# EAGLE design GBC USB-C Charging Kit (EAGLE 6.2)
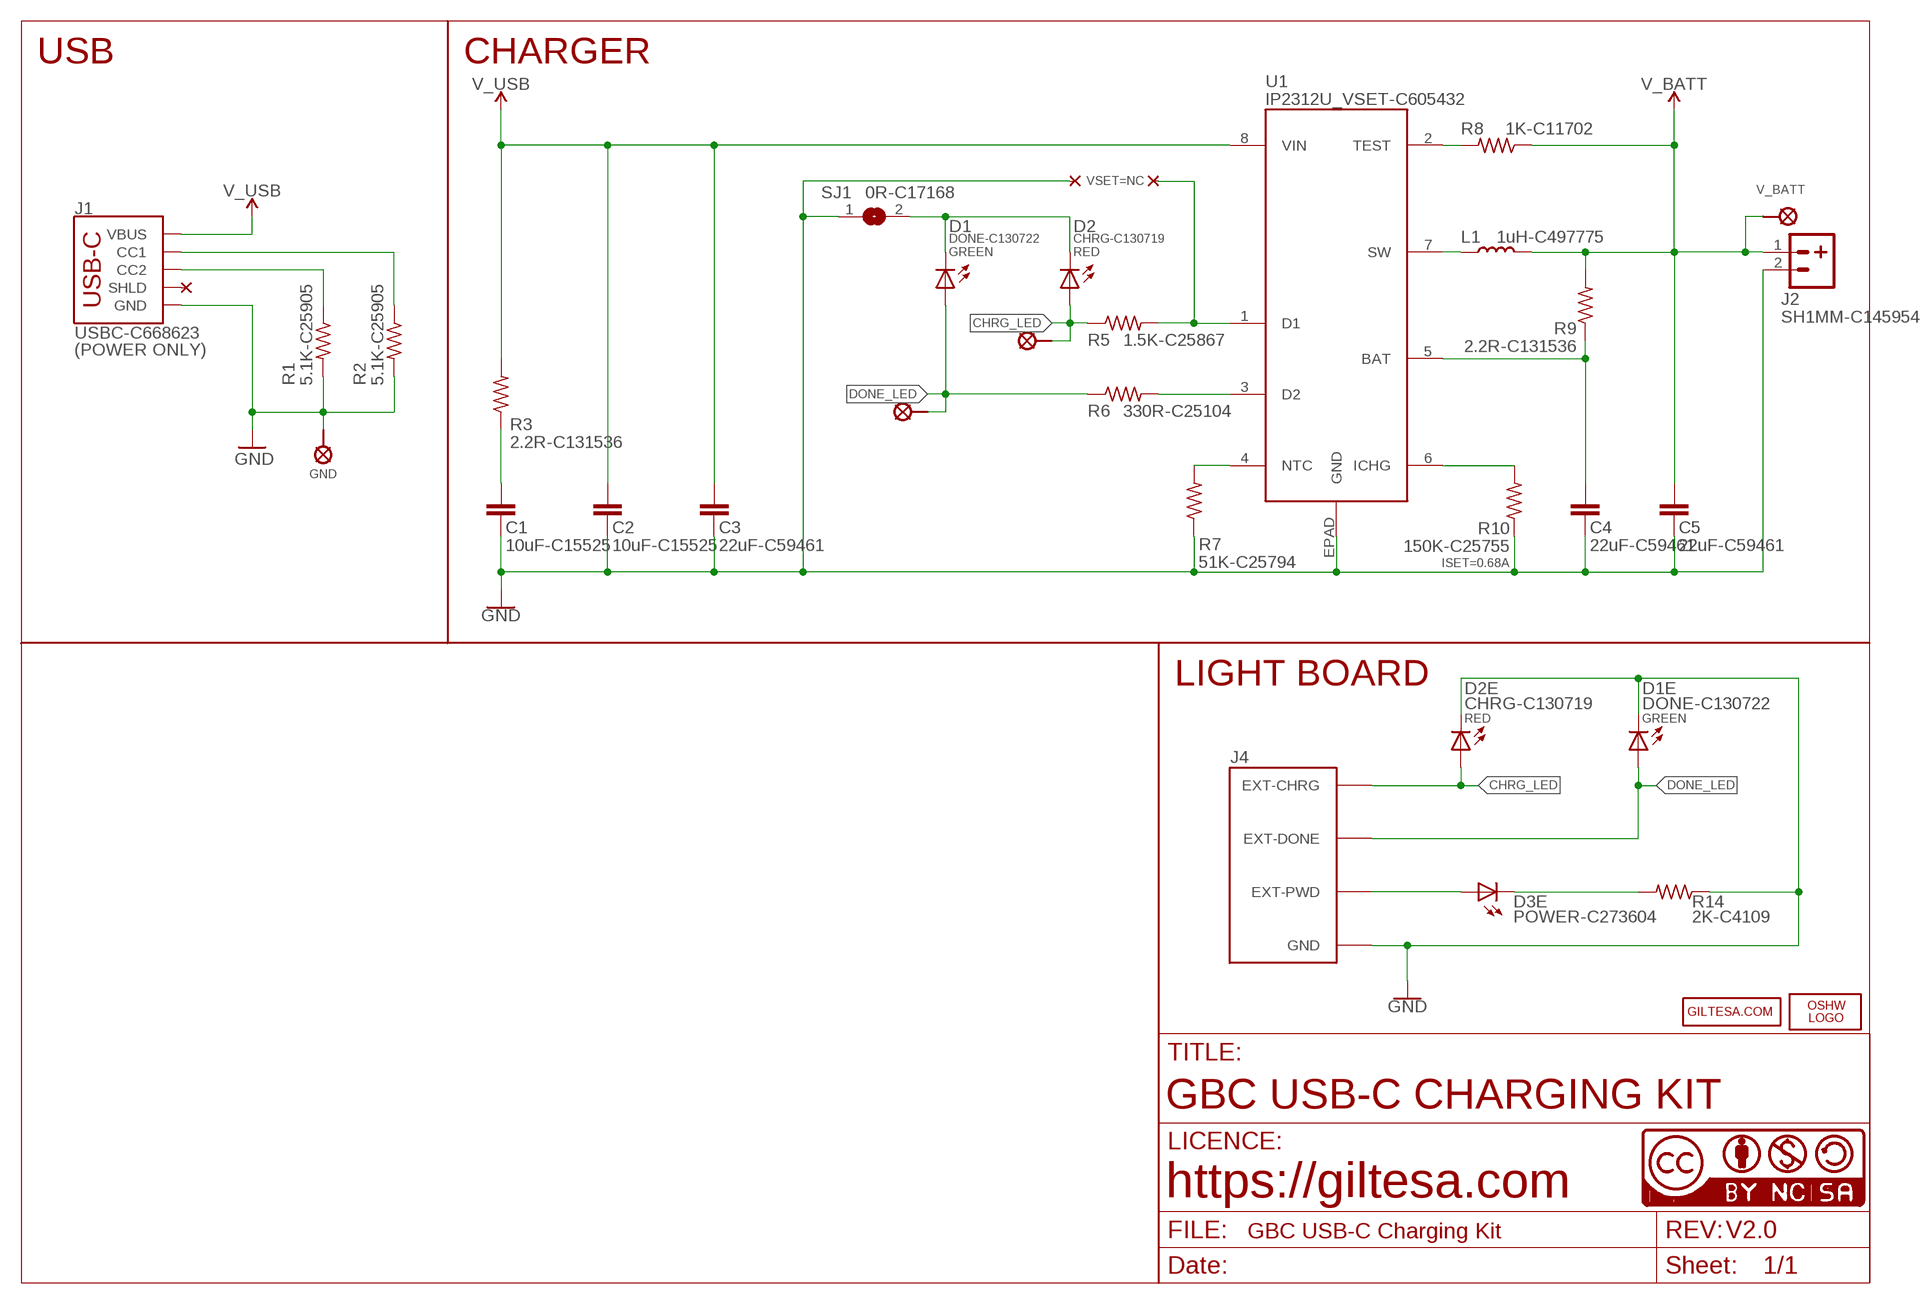
[diagram p0: schematic, sheet 1]

## Parts
C1  10uF-C15525  C0402_S  [C0402_S]
C2  10uF-C15525  C0402_S  [C0402_S]
C3  22uF-C59461  C0603_SMALL  [C0603_S]
C4  22uF-C59461  C0603_SMALL  [C0603_S]
C5  22uF-C59461  C0603_SMALL  [C0603_S]
D1  DONE-C130722  LED_0402  [L0402]
D1E  DONE-C130722  LED_0402  [L0402]
D2  CHRG-C130719  LED_0402  [L0402]
D2E  CHRG-C130719  LED_0402  [L0402]
D3E  POWER-C273604  LED_0402  [L0402]
J1  USBC-C668623  USB-C_6P_POWER  [USB-C_6P]
J2  SH1MM-C145954  JST-21MM  [JST-2-1MM-SMD_RIGHT]
J4  GBC_LED_V2  [GBC_LED_V2]
L1  1uH-C497775  INDUCTOR_2  [PSPMAA0402]
LOGO2  OSHW_LOGO_FILLX0150-NT  [OSHW_FILLX150_NOTEXT]
R1  5.1K-C25905  R0402  [R0402]
R2  5.1K-C25905  R0402  [R0402]
R3  2.2R-C131536  R0402  [R0402]
R5  1.5K-C25867  R0402  [R0402]
R6  330R-C25104  R0402  [R0402]
R7  51K-C25794  R0402  [R0402]
R8  1K-C11702  R0402  [R0402]
R9  2.2R-C131536  R0402  [R0402]
R10  150K-C25755  R0402  [R0402]
R14  2K-C4109  R0402  [R0402]
SJ1  0R-C17168  JUMPER-SMD0402  [JUMPER-SMD_0402]
U1  IP2312U_VSET-C605432  IP2312_CUSTOM  [IP2312]
U$1  V_BATT  PAD_1.25  [PAD_1.25]
U$2  GND  PAD_1.25  [PAD_1.25]
U$6  CC-BY-NC-SA15MM  [CC-BY-NC-SA_15MM]
U$16  GILTESA.COM_MASK  [GILTESA.COM_MASK_15MM]
U$17  CC-NC-BCNIX  [CC-NC-B_NIX]
U$24  CHRG_LED  SOLDER_PAD-1.3  [SOLDER_PAD_1.3]
U$25  DONE_LED  SOLDER_PAD-1.3  [SOLDER_PAD_1.3]

## Nets
CHRG_LED: D2.A D2E.A J4.EXT-CHRG R5.1 U$24.P$1
DONE_LED: D1.A D1E.A J4.EXT-DONE R6.1 U$25.P$1
GND: C1.1 C2.1 C3.1 C4.1 C5.1 D1E.C D2E.C J1.A12-GND(GND) J1.B12-GND(GND) J2.2 J4.GND R1.2 R2.2 R7.1 R10.1 R14.1 SJ1.1 U1.EPAD(GND) U$2.P$1
N$1: D1.C D2.C SJ1.2
N$4: J1.B5(CC2) R1.1
N$6: R8.2 U1.2(TEST)
N$10: D3E.A J4.EXT-PWD
N$11: D3E.C R14.2
N$13: J1.A5(CC1) R2.1
N$14: C4.2 R9.1 U1.5(BAT)
N$15: C1.2 R3.1
N$19: R5.2 U1.1(D1)
N$27: R7.2 U1.4(NTC)
N$28: R10.2 U1.6(ICHG)
N$29: R6.2 U1.3(D2)
N$31: L1.P$1 U1.7(SW)
V_BATT: C5.2 J2.1 L1.P$2 R8.1 R9.2 U$1.P$1
V_USB: C2.2 C3.2 J1.A9-VBUS(VBUS) J1.B9-VBUS(VBUS) R3.2 U1.8(VIN)
Unconnected: J1.SHLD1(SHLD) J1.SHLD2(SHLD) J1.SHLD3(SHLD) J1.SHLD4(SHLD)

## Notes on the sheet
- USB | CHARGER
- VSET=NC
- GREEN | RED
- (POWER ONLY)
- ISET=0.68A
- LIGHT BOARD
- RED | GREEN
- GBC USB-C CHARGING KIT
- https://giltesa.com
- V2.0

## Library data of the parts
C1 C2 = ,giltesa:C0402
C3-C5 = ,giltesa:C0603
D1 D1E D2 D2E D3E = ,giltesa:LED
J1 = ,giltesa:USB-C_6P
J2 = ,giltesa:JST-2
J4 = ,giltesa:GBC_LED_V2
L1 = ,giltesa:INDUCTOR
LOGO2 = ohw-logo:OSHW_LOGO_FILL
R1-R3 R5-R10 R14 = ,giltesa:R0402
SJ1 = ,giltesa:JUMPER-SMD
U1 = ,giltesa:IP2312
U$1 U$2 = ,giltesa:PAD
U$6 = ,giltesa_logos:CC-BY-NC-SA
U$16 = ,giltesa_logos:GILTESA.COM
U$17 = cc-by-nc-sa:CC-NC-BC: All hardware is licensed under the Creative Commons Attribution-Noncommercial-Share Alike 2.5 Switzerland License. To view a copy of this license, visit http://creativecommons.org/licenses/by-nc-sa/2.5/ch/ or send a letter to Creative Commons, 171 Second Street, Suite 300, San Francisco, California, 94105, USA.
U$24 U$25 = ,giltesa:SOLDER_PAD

## Net classes
1 power: width 0.61 mm, drill 0.406 mm, clearance 0.203 mm
2 gnd: width 0.305 mm, drill 0.406 mm, clearance 0.203 mm
3 power usb: width 0.508 mm, drill 0.406 mm, clearance 0.203 mm

## Board
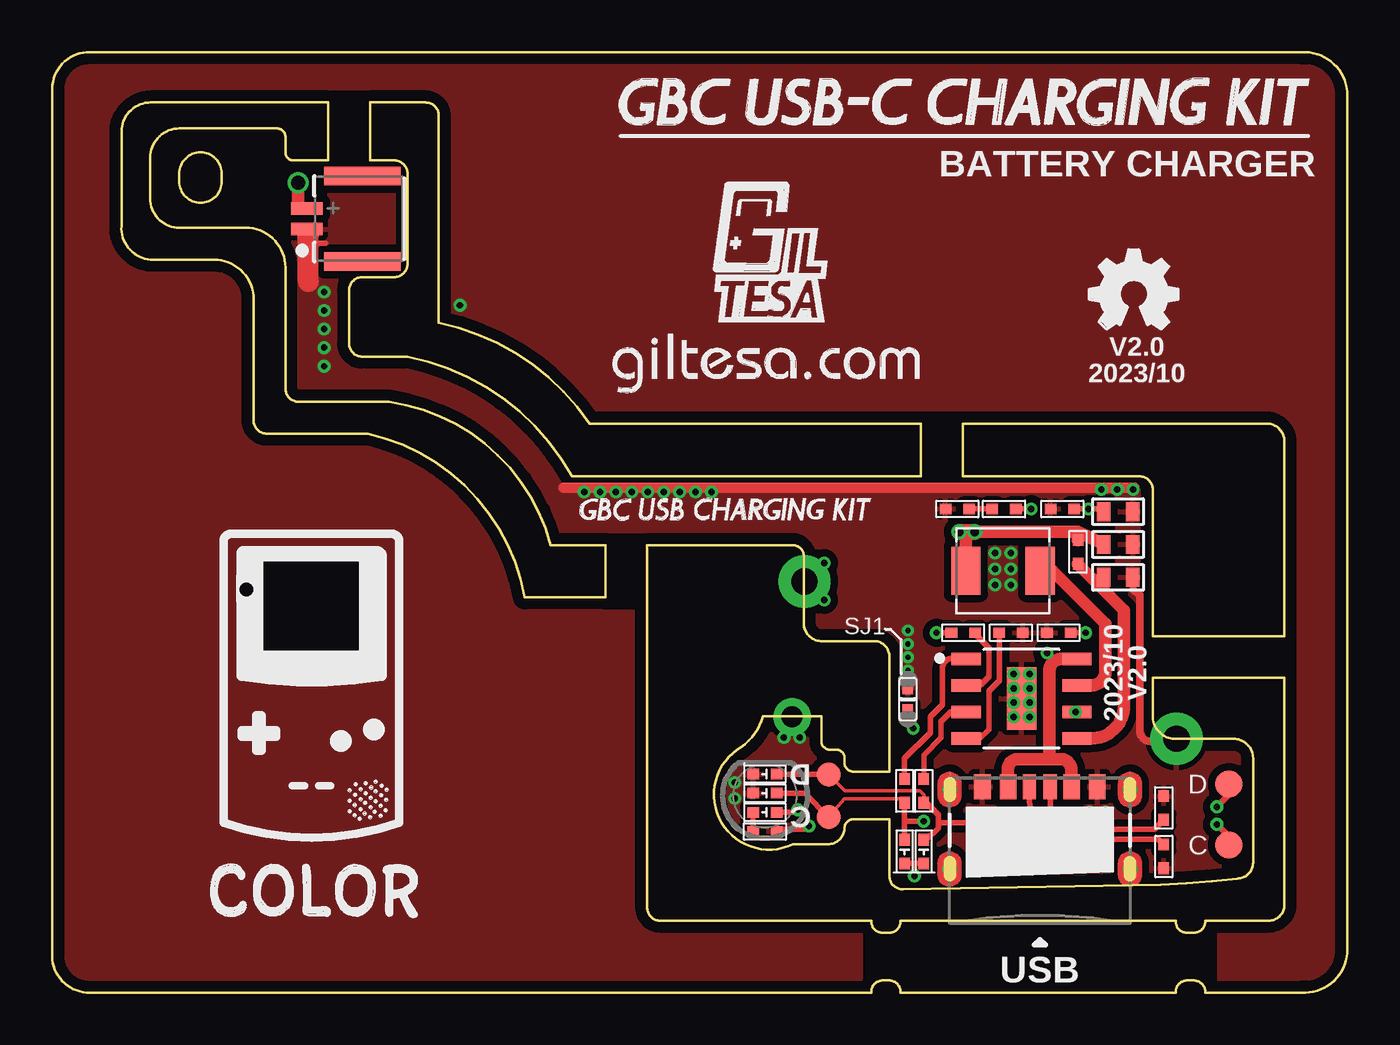
[diagram p1: board, top side]
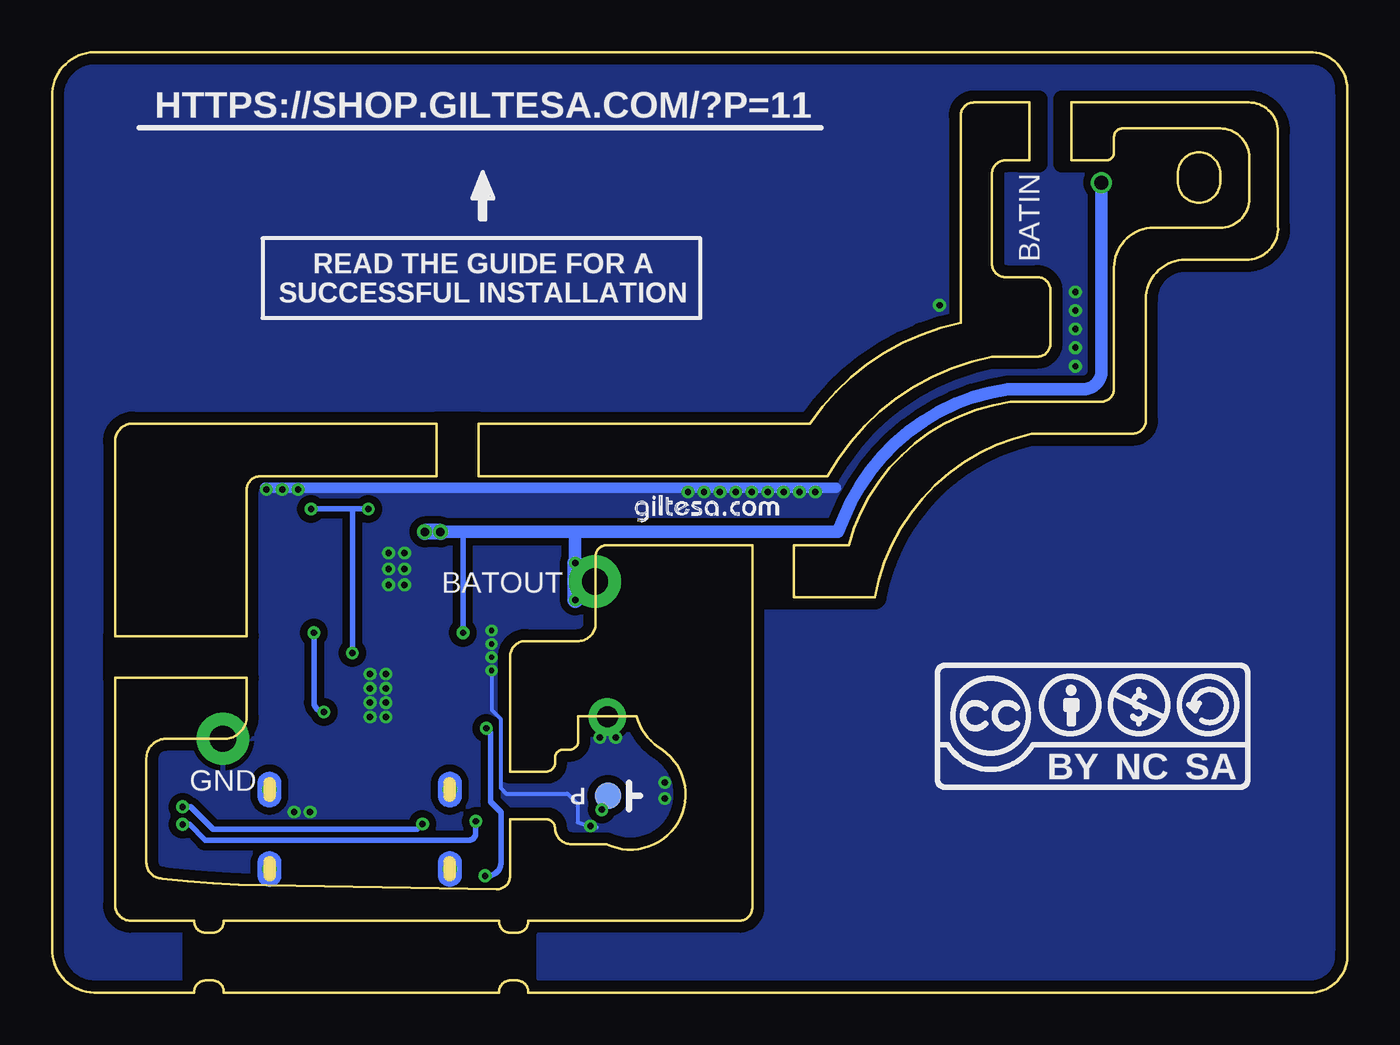
[diagram p2: board, bottom side, seen from below]

Size 62 x 45.01 mm. Coordinates in mm from the lower left corner, seen from the top.
Outline: 57.49,11.13 57.49,6.21 arc-90 56.75,5.46 arc-5 53.07,5.16 40.72,4.94 arc-90 40.09,5.58 40.09,8.3 38.39,8.3 arc90 37.94,7.92 arc-90 37.14,7.1 35.46,7.1 arc-170 32.79,11.63 arc45 34.03,13.22 36.82,13.22 36.82,12.08 arc90 37.2,11.63 37.56,11.63 arc-90 37.94,11.19 37.94,11.03 arc90 38.31,10.58 40.09,10.58 40.09,16.13 arc90 39.31,16.83 36.79,16.83 arc-90 35.99,17.75 35.99,20.91 arc90 35.42,21.42 28.49,21.42 28.49,4.09 arc90 29.09,3.44 39.22,3.44 arc90 39.73,2.87 40.11,2.87 arc90 40.61,3.44 53.79,3.44 arc90 54.3,2.87 54.68,2.87 arc90 55.2,3.44 58.25,3.44 arc90 58.99,4.2 58.99,15.07 52.69,15.07 52.69,13.17 arc90 53.84,12.15 56.63,12.15 arc-90 57.49,11.13
Outline: 1.64,0 39.22,0 arc-90 39.73,0.58 40.11,0.58 arc-90 40.61,0 53.79,0 arc-90 54.3,0.58 54.68,0.58 arc-90 55.2,0 59.81,0 arc90 62,1.91 62,43.1 arc90 59.81,45 1.64,45 arc90 0,43.1 0,1.91 arc90 1.64,0
Outline: 24.88,24.71 41.59,24.71 41.59,27.24 25.72,27.24 arc44 18.51,32.06 18.51,41.98 arc90 17.87,42.61 15.21,42.61 15.21,39.84 16.37,39.84 arc-90 17.01,39.2 17.01,34.88 arc-90 16.37,34.25 14.85,34.25 arc90 14.21,33.61 14.21,31.07 arc90 14.85,30.44 17.01,30.44 arc-50 24.88,24.71
Outline: 43.59,24.71 52.06,24.71 arc-90 52.69,24.09 52.69,17.07 58.99,17.07 58.99,26.37 arc90 58.16,27.24 43.59,27.24 43.59,24.71
Outline: 16.12,28.28 11.8,28.28 arc-90 11.17,28.91 11.17,34.7 arc90 9.26,36.61 6.09,36.61 arc-90 4.69,38.01 4.69,39.96 arc-90 6.09,41.36 10.78,41.36 arc-90 11.17,40.98 11.17,40.22 arc90 11.55,39.84 13.21,39.84 13.21,42.61 4.71,42.61 arc90 3.32,41.21 3.32,36.68 arc90 4.71,35.09 7.74,35.09 arc-90 9.64,33.18 9.64,27.39 arc90 10.28,26.75 15.12,26.75 arc-67 22.62,18.92 26.49,18.92 26.49,21.42 23.87,21.42 arc67 16.12,28.28
Outline: 6.09,39.2 arc-180 8.12,39.2 8.12,38.82 arc-180 6.09,38.82 6.09,39.2
Copper layers (1*16): Top 0.035mm / dielectric 1.6mm / Bottom 0.035mm
Design rules: minimum track width 6mil, minimum drill 12mil, track to track 6mil, track to pad 6mil, pad to pad 6mil, via to via 8mil, smd to smd 0mil, copper to edge 20mil, drill to drill 10mil, minimum pad ring 6mil, minimum via ring 6mil, stop-mask expansion 0mil, vias tented up to drill 100mil, thermal gap 10mil
tRestrict: area 10.4,16.6 to 14.5,20.4; area 9.4,19.3 to 9.4,19.3; 16 lines
bRestrict: 20 lines

### Footprints (pad centres in the part's own frame; a part is rotated, then mirrored left to right if it is on the bottom)
C0402_S = smd 0.559 x 0.5: 1 -0.567,0; 2 0.567,0
C0603_S = smd 0.635 x 0.9: 1 -0.694,0; 2 0.694,0
L0402 = smd 0.559 x 0.5: A 0.567,0; C -0.567,0
USB-C_6P = smd 0.635 x 1.2: A5 -0.5,2.034; B5 0.5,2.034 | smd 0.8 x 1.2: A9-VBUS 1.52,2.034; A12-GND 2.75,2.034; B9-VBUS -1.52,2.034; B12-GND -2.75,2.034 | drill 0.4 pad 0.6: SHLD1 -4.318,1.9; SHLD2 4.32,1.9; SHLD3 -4.318,-1.9; SHLD4 4.32,-1.9
JST-2-1MM-SMD_RIGHT = smd 0.6 x 1.524: 1 -0.5,-2.017; 2 0.5,-2.017 | smd 0.889 x 3.683: NC1 -2.054,0.635; NC2 2.054,0.635
GBC_LED_V2 = smd 1.143 x 1.143: EXT-CHRG -3.048,1.016; EXT-DONE -3.048,-1.016 | smd 1.27 x 1.27 bottom: EXT-PWD -1.27,0 | drill 1 pad 1.8: GND -1.293,-3.778
PSPMAA0402 = smd 1.4 x 2.3: P$1 -1.775,0; P$2 1.775,0
R0402 = smd 0.559 x 0.5: 1 -0.567,0; 2 0.567,0
JUMPER-SMD_0402 = smd 0.635 x 0.5: 1 -0.559,0; 2 0.559,0
IP2312 = smd 1.4 x 0.6: 1 -2.65,1.905; 2 -2.65,0.635; 3 -2.65,-0.635; 4 -2.65,-1.905; 5 2.65,-1.905; 6 2.65,-0.635; 7 2.65,0.635; 8 2.65,1.905 | smd 1.4 x 3: EPAD 0,0
PAD_1.25 = drill 1.25 pad 2.5: P$1 0,0
SOLDER_PAD_1.3 = smd 1.3 x 1.3: P$1 0,0

### Placement (x,y rotation side)
C1  43.34,23.15 0 top
C2  48.37,23.15 0 top
C3  51.03,23.02 180 top
C4  51.03,19.88 180 top
C5  51.03,21.45 180 top
D1  41.73,6.75 90 top
D1E  34.13,10.46 0 top
D2  40.81,6.75 90 top
D2E  34.13,9.55 0 top
D3E  34.13,8.63 0 top
J1  47.28,7.82 0 top
J2  14.21,37.04 270 top
J4  34.13,9.42 180 top
L1  45.52,20.2 180 top
LOGO2  49.66,31.75 0 top
R1  53.22,8.84 90 top
R2  53.22,6.52 270 top
R3  45.57,23.15 0 top
R5  40.81,9.66 90 top
R6  41.73,9.66 90 top
R7  45.9,17.23 180 top
R8  43.61,17.23 0 top
R9  49.11,21.1 90 top
R10  48.19,17.23 0 top
R14  34.13,7.72 180 top
SJ1  40.97,14.05 270 top
U1  46.41,14.07 0 top
U$1  36.01,19.68 0 top
U$2  53.83,12.16 0 top
U$3  [GBC_FRAME]  27.18,41.47 0 top
U$6  19.75,9.7 0 bottom
U$8  [GBC_FRAME_LOGO]  7.53,3.56 0 top
U$14  [GAME_BOY_COLOR_USB_CHARGING_KIT_NON]  25.15,22.61 0 top
U$16  26.71,28.6 0 top
U$17  0,0 0 top
U$18  [GILTESA_LOGO_MASK_7MM]  31,32 0 top
U$24  56.33,7.07 0 top
U$25  56.33,9.99 0 top
U$28  [GILTESA.COM_MASK_7MM@1]  34.14,22.46 0 bottom

### Tracks (layer width: path | path; a pad name or v marks a point on that pad's centre or on a via)
CHRG_LED  (via drill 0.3)
  Top 0.178: R5.1 40.56,9.28 37.94,9.28 J4.EXT-CHRG
  Top 0.254: D2E.A 36.03,9.55 J4.EXT-CHRG | D2.A 40.81,8.21 | R5.1 40.81,8.21 | 40.81,8.21 v41.73,8.21 | U$24.P$1 56.33,7.48 v55.76,8.06
  Bottom 0.254: v55.76,8.06 55.43,8.06 54.69,7.29 42.07,7.29 arc-90 41.73,7.63 v41.73,8.21
DONE_LED  (via drill 0.3)
  Top 0.178: R6.1 41.73,9.46 41.53,9.66 37.95,9.66 J4.EXT-DONE
  Top 0.203: R6.1 41.79,8.96 41.79,9.09
  Top 0.254: D1E.A 37.15,10.46 J4.EXT-DONE | R6.1 41.79,9.09 41.84,9.09 42.42,8.51 42.42,8.13 | U$25.P$1 56.33,9.47 v55.76,8.89 | D1.A 41.87,7.32 42.42,7.88 42.42,8.13 | v44.28,8.07 v44.26,8.07 44.2,8.13 42.42,8.13
  Bottom 0.254: v55.76,8.89 55.38,8.89 54.3,7.82 44.53,7.82 v44.28,8.07
GND  (via drill 0.25, 0.3)
  Top 0.203: SJ1.1 v40.97,15.42
  Top 0.254: R14.1 34.75,7.77 34.79,7.77 34.85,7.83 36.09,7.83 v36.23,7.97 | v35.03,12.21 J4.GND | 12.7,35.87 13.09,35.87 | 51.75,24.16 v51.75,24.09
  Top 0.305: C4.1 51.73,19.27
  Top 0.356: 51.73,19.27 52.07,19.05 52.07,12.45 arc90 52.75,12.03 U$2.P$1
  Top 0.508: 24.49,24.16 51.75,24.16 51.82,24.16
  Top 1.016: 12.26,34.04 12.26,36.23
  Bottom 0.203: 35.93,7.9 v36.23,7.97 36.47,8.02 36.83,8.13 36.83,9.02 37.34,9.53 40.26,9.53 40.52,9.78 40.52,13.09 40.97,13.53 v40.97,15.42
  Bottom 0.254: v35.79,12.21 J4.GND | v51.75,24.09 51.69,24.09 51.69,24.16
  Bottom 0.508: 24.49,24.16 51.69,24.16 51.82,24.16
  other vias: 32.68,10.05 32.68,9.29 46.03,15.25 46.79,15.25 46.03,14.57 46.79,14.57 46.79,13.88 46.03,13.88 46.03,13.19 46.79,13.19 49.66,8.64 50.42,8.64 40.97,16.06 40.97,16.69 13.02,33.54 13.02,32.65 13.02,31.76 13.02,30.87 13.02,29.98 25.47,23.96 26.23,23.96 26.99,23.96 27.75,23.96 28.51,23.96 29.28,23.96 30.04,23.96 30.8,23.96 31.56,23.96 45.14,21.04 45.9,21.04 45.14,20.28 45.9,20.28 45.14,19.52 45.9,19.52 50.99,24.09 50.23,24.09 40.97,17.33 19.52,32.9
  pour Top (isolate 0.356): -1,46 63,46 63,-1 -1,-1
  pour Bottom (isolate 0.356): -1,46 63,46 63,-1 -1,-1
N$1  (via drill 0.3)
  Top 0.254: v41.28,5.59 41.28,6.19 | SJ1.2 40.97,12.91 v41.22,12.65 | D2.C 41.28,6.19 | 41.28,6.19 D1.C
  Bottom 0.254: v41.22,12.65 v41.22,12.64 41.03,12.45 41.03,9.15 40.52,8.64 40.52,6.23 arc90 41.15,5.59 v41.28,5.59
N$4
  Top 0.254: J1.B5 47.78,8.93 arc90 49.03,7.82 52.76,7.82 R1.1
N$6
  Top 0.254: U1.2 43.79,14.74 44.45,14.74 44.84,15.12 44.84,16.51 44.18,17.17 R8.2
N$10  (via drill 0.3)
  Top 0.254: D3E.A 35.56,8.63 v35.69,8.76
  Bottom 0.254: J4.EXT-PWD 35.4,8.93 v35.69,8.76
N$11
  Top 0.254: D3E.C R14.2
N$13
  Top 0.254: J1.A5 46.78,9.34 arc90 48.77,7.35 52.96,7.35 R2.1
N$14
  Top 0.61: U1.5 49.76,12.17 arc90 51.31,13.72 51.31,18.29 50.04,19.56 | 50.34,19.73 C4.2 50.04,19.58 50.04,19.56 | 50.04,19.56 49.11,20.49 R9.1
N$15
  Top 0.254: C1.2 R3.1
N$19
  Top 0.254: 44.33,16.01 43.79,16.01 | 43.79,16.01 U1.1 | R5.2 40.81,11.22 42.04,12.45 42.04,13.21 42.61,13.78 42.61,15.5 arc-90 43.12,16.01 43.79,16.01
N$27
  Top 0.254: U1.4 44.43,12.17 44.84,12.58 44.84,14.42 45.34,14.93 R7.2
N$28  (via drill 0.3)
  Top 0.254: R10.2 v49.47,17.23 | v49,13.44 U1.6
  Bottom 0.254: v49.47,17.23 49.47,13.91 arc-90 v49,13.44
N$29
  Top 0.254: R6.2 41.73,11.37 42.55,12.2 42.55,12.96 43.03,13.44 U1.3
N$31
  Top 0.61: U1.7 49.76,14.71 arc90 50.42,15.37 50.42,17.66 47.89,20.2 L1.P$1 arc-90 47.63,19.99 47.63,19.61
V_BATT  (via drill 0.3, 0.41, 0.66)
  Top 0.254: R8.1 v42.34,17.23
  Top 0.406: 11.77,37.6 12.2,37.6 J2.1
  Top 0.61: 11.77,37.6 v11.77,38.77 | 49.11,22.06 v44.18,22.06 43.74,22.06 L1.P$2 | 49.11,22.06 R9.2 | C5.2 49.11,22.06
  Top 0.762: v43.41,22.06 v44.18,22.06
  Bottom 0.254: v42.34,17.23 42.34,22.02 42.3,22.06
  Bottom 0.61: v11.77,38.77 11.77,29.68 arc90 12.69,28.89 16.25,28.89 arc-60 24.12,22.69 24.37,22.06 37.09,22.06 | 37.09,22.06 42.3,22.06 43.39,22.06 | v36.96,18.79 36.96,18.8 | U$1.P$1 36.82,19.68 36.96,19.69 | v36.96,20.57 36.96,21.93 37.09,22.06
  Bottom 0.762: v36.96,20.57 36.96,19.69 36.96,18.8 | 43.39,22.06 v44.18,22.06
V_USB  (via drill 0.3)
  Top 0.254: R3.2 v46.87,23.15 | C2.2 v49.61,23.15 50.21,23.15 C3.2 | U1.8 47.91,15.98 v47.63,16.26
  Top 0.584: U1.8 48.34,15.98
  Top 0.61: 47.73,11.18 46.23,11.18 arc90 45.76,10.71 J1.B9-VBUS | 47.73,11.18 47.73,15.37 arc-90 48.34,15.98 | 47.73,11.18 48.26,11.18 arc-90 48.8,10.64 J1.A9-VBUS
  Bottom 0.254: v46.87,23.15 47.63,23.15 | 47.63,23.15 v49.61,23.15 | v47.63,16.26 47.63,23.15

### Text on the board
tPlace: BATTERY CHARGER | V2.0 | 2023/10 | SJ1 | 2023/10 | V2.0 | D | C | USB
bPlace: HTTPS://SHOP.GILTESA.COM/?P=11 | BATIN | READ THE GUIDE FOR A | SUCCESSFUL INSTALLATION | BATOUT | GND